# EAGLE schematic balancer (EAGLE 9.6.2)
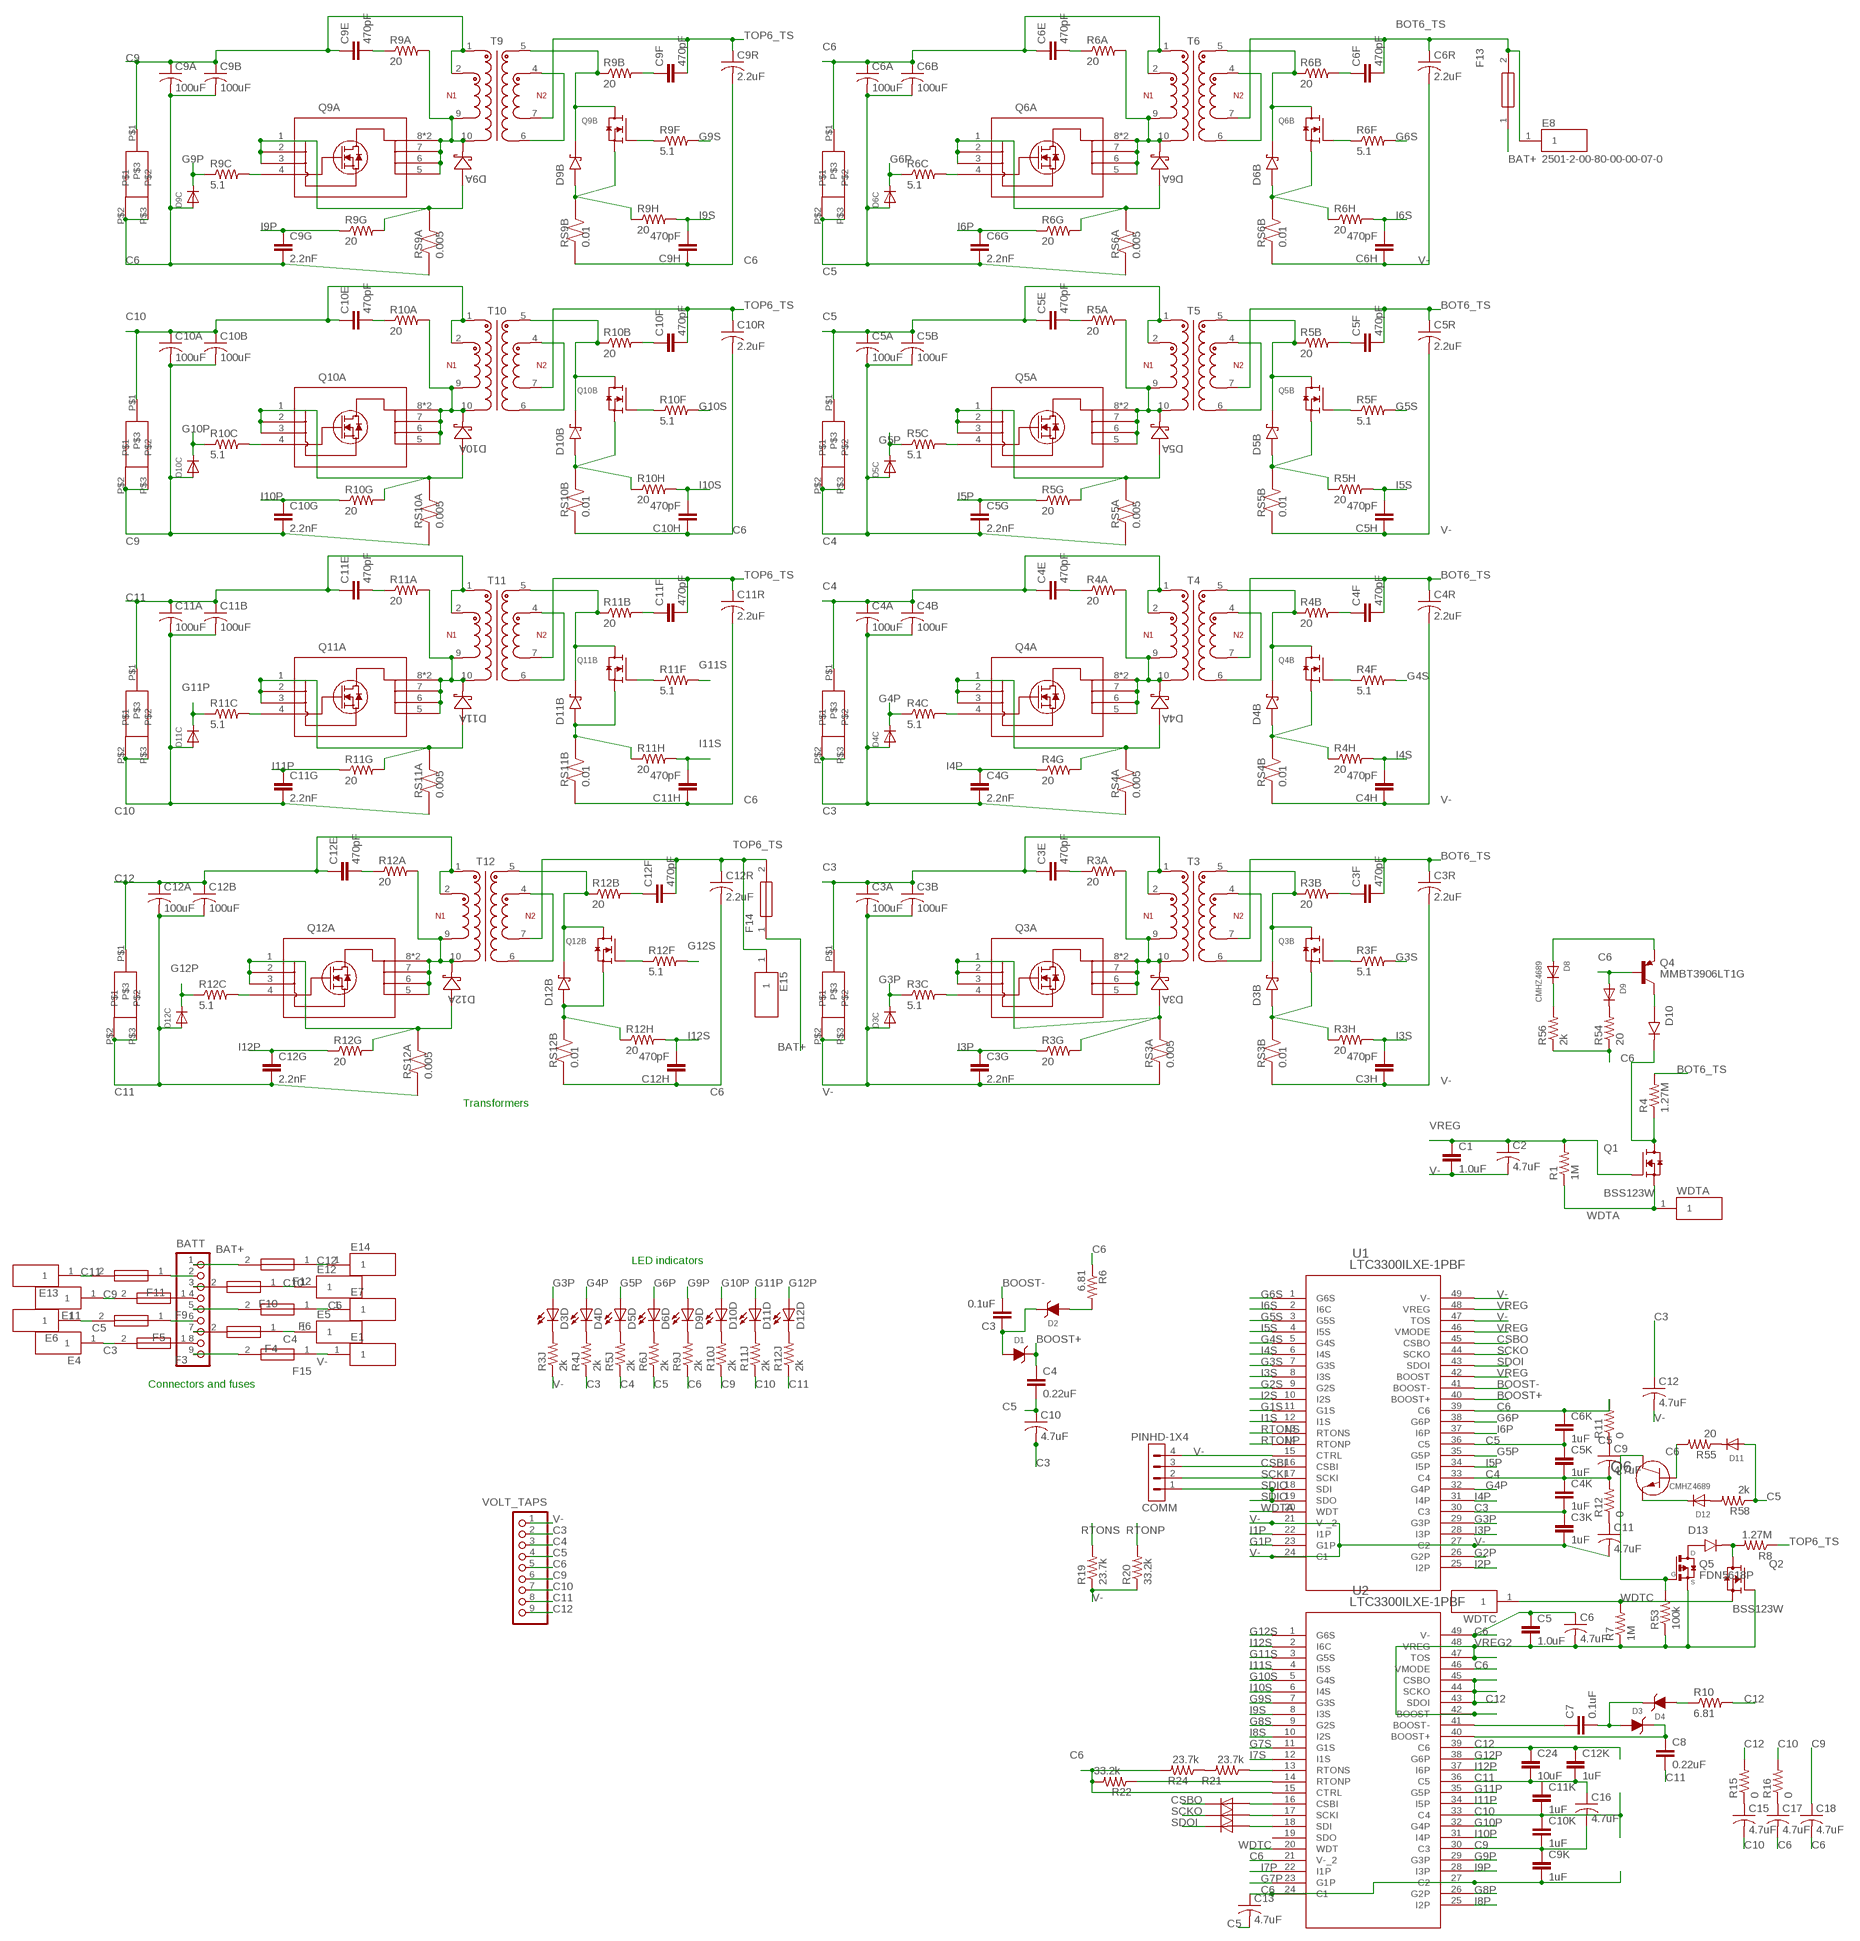
[diagram p0: schematic, sheet 1]

## Parts
BATT  B9P-VH  [B9P-VH]
C1  1.0uF  CAP  [0805]
C2  4.7uF  C-USC1210  [C1210]
C3  0.1uF  CAP  [0805]
C3A  100uF  C-USC1210  [C1210]
C3B  100uF  C-USC1210  [C1210]
C3E  470pF  CAP  [0805]
C3F  470pF  CAP  [0805]
C3G  2.2nF  CAP  [0805]
C3H  470pF  CAP  [0805]
C3K  1uF  CAP  [0805]
C3R  2.2uF  C-USC1210  [C1210]
C4  0.22uF  CAP  [0805]
C4A  100uF  C-USC1210  [C1210]
C4B  100uF  C-USC1210  [C1210]
C4E  470pF  CAP  [0805]
C4F  470pF  CAP  [0805]
C4G  2.2nF  CAP  [0805]
C4H  470pF  CAP  [0805]
C4K  1uF  CAP  [0805]
C4R  2.2uF  C-USC1210  [C1210]
C5  1.0uF  CAP  [0805]
C5A  100uF  C-USC1210  [C1210]
C5B  100uF  C-USC1210  [C1210]
C5E  470pF  CAP  [0805]
C5F  470pF  CAP  [0805]
C5G  2.2nF  CAP  [0805]
C5H  470pF  CAP  [0805]
C5K  1uF  CAP  [0805]
C5R  2.2uF  C-USC1210  [C1210]
C6  4.7uF  C-USC1210  [C1210]
C6A  100uF  C-USC1210  [C1210]
C6B  100uF  C-USC1210  [C1210]
C6E  470pF  CAP  [0805]
C6F  470pF  CAP  [0805]
C6G  2.2nF  CAP  [0805]
C6H  470pF  CAP  [0805]
C6K  1uF  CAP  [0805]
C6R  2.2uF  C-USC1210  [C1210]
C7  0.1uF  CAP  [0805]
C8  0.22uF  CAP  [0805]
C9  4.7uF  C-USC1210  [C1210]
C9A  100uF  C-USC1210  [C1210]
C9B  100uF  C-USC1210  [C1210]
C9E  470pF  CAP  [0805]
C9F  470pF  CAP  [0805]
C9G  2.2nF  CAP  [0805]
C9H  470pF  CAP  [0805]
C9K  1uF  CAP  [0805]
C9R  2.2uF  C-USC1210  [C1210]
C10  4.7uF  C-USC1210  [C1210]
C10A  100uF  C-USC1210  [C1210]
C10B  100uF  C-USC1210  [C1210]
C10E  470pF  CAP  [0805]
C10F  470pF  CAP  [0805]
C10G  2.2nF  CAP  [0805]
C10H  470pF  CAP  [0805]
C10K  1uF  CAP  [0805]
C10R  2.2uF  C-USC1210  [C1210]
C11  4.7uF  C-USC1210  [C1210]
C11A  100uF  C-USC1210  [C1210]
C11B  100uF  C-USC1210  [C1210]
C11E  470pF  CAP  [0805]
C11F  470pF  CAP  [0805]
C11G  2.2nF  CAP  [0805]
C11H  470pF  CAP  [0805]
C11K  1uF  CAP  [0805]
C11R  2.2uF  C-USC1210  [C1210]
C12  4.7uF  C-USC1210  [C1210]
C12A  100uF  C-USC1210  [C1210]
C12B  100uF  C-USC1210  [C1210]
C12E  470pF  CAP  [0805]
C12F  470pF  CAP  [0805]
C12G  2.2nF  CAP  [0805]
C12H  470pF  CAP  [0805]
C12K  1uF  CAP  [0805]
C12R  2.2uF  C-USC1210  [C1210]
C13  4.7uF  C-USC1210  [C1210]
C15  4.7uF  C-USC1210  [C1210]
C16  4.7uF  C-USC1210  [C1210]
C17  4.7uF  C-USC1210  [C1210]
C18  4.7uF  C-USC1210  [C1210]
C24  10uF  CAP  [0805]
COMM  PINHD-1X4  [1X04]
D1  WE-TVSP_DO-214AA_600W_UNI  [WE-TVSP_DO-214AA_UNIDIRECTIONAL]
D2  WE-TVSP_DO-214AA_600W_UNI  [WE-TVSP_DO-214AA_UNIDIRECTIONAL]
D3  WE-TVSP_DO-214AA_600W_UNI  [WE-TVSP_DO-214AA_UNIDIRECTIONAL]
D3A  DFLS260Q-7  [SDO_POWERDI123_DIO]
D3B  DFLS1100-7  [DIO_DFLS1100-7]
D3C  DIODESOD-523  [SOD-523]
D3D  LEDCHIPLED_0805  [CHIPLED_0805]
D3E  SBR10U200P5  [POWERDI5]
D4  WE-TVSP_DO-214AA_600W_UNI  [WE-TVSP_DO-214AA_UNIDIRECTIONAL]
D4A  DFLS260Q-7  [SDO_POWERDI123_DIO]
D4B  DFLS1100-7  [DIO_DFLS1100-7]
D4C  DIODESOD-523  [SOD-523]
D4D  LEDCHIPLED_0805  [CHIPLED_0805]
D4E  SBR10U200P5  [POWERDI5]
D5  RS07J-GS18  [SODFL3718X108N]
D5A  DFLS260Q-7  [SDO_POWERDI123_DIO]
D5B  DFLS1100-7  [DIO_DFLS1100-7]
D5C  DIODESOD-523  [SOD-523]
D5D  LEDCHIPLED_0805  [CHIPLED_0805]
D5E  SBR10U200P5  [POWERDI5]
D6  RS07J-GS18  [SODFL3718X108N]
D6A  DFLS260Q-7  [SDO_POWERDI123_DIO]
D6B  DFLS1100-7  [DIO_DFLS1100-7]
D6C  DIODESOD-523  [SOD-523]
D6D  LEDCHIPLED_0805  [CHIPLED_0805]
D6E  SBR10U200P5  [POWERDI5]
D7  RS07J-GS18  [SODFL3718X108N]
D8  CMHZ4689  DIODESOD-123  [SOD-123]
D9  PDZ5.6B  DIODESOD-323F  [SOD-323F]
D9A  DFLS260Q-7  [SDO_POWERDI123_DIO]
D9B  DFLS1100-7  [DIO_DFLS1100-7]
D9C  DIODESOD-523  [SOD-523]
D9D  LEDCHIPLED_0805  [CHIPLED_0805]
D9E  SBR10U200P5  [POWERDI5]
D10  1N4448HWT-7  [SODFL1608X65N]
D10A  DFLS260Q-7  [SDO_POWERDI123_DIO]
D10B  DFLS1100-7  [DIO_DFLS1100-7]
D10C  DIODESOD-523  [SOD-523]
D10D  LEDCHIPLED_0805  [CHIPLED_0805]
D10E  SBR10U200P5  [POWERDI5]
D11  PDZ5.6B  DIODESOD-323F  [SOD-323F]
D11A  DFLS260Q-7  [SDO_POWERDI123_DIO]
D11B  DFLS1100-7  [DIO_DFLS1100-7]
D11C  DIODESOD-523  [SOD-523]
D11D  LEDCHIPLED_0805  [CHIPLED_0805]
D11E  SBR10U200P5  [POWERDI5]
D12  CMHZ4689  DIODESOD-123  [SOD-123]
D12A  DFLS260Q-7  [SDO_POWERDI123_DIO]
D12B  DFLS1100-7  [DIO_DFLS1100-7]
D12C  DIODESOD-523  [SOD-523]
D12D  LEDCHIPLED_0805  [CHIPLED_0805]
D12E  SBR10U200P5  [POWERDI5]
D13  1N4448HWT-7  [SODFL1608X65N]
E1  2501-2-00-80-00-00-07-0  [MILMAX_2501-2-00-80-00-00-07-0]
E4  2501-2-00-80-00-00-07-0  [MILMAX_2501-2-00-80-00-00-07-0]
E5  2501-2-00-80-00-00-07-0  [MILMAX_2501-2-00-80-00-00-07-0]
E6  2501-2-00-80-00-00-07-0  [MILMAX_2501-2-00-80-00-00-07-0]
E7  2501-2-00-80-00-00-07-0  [MILMAX_2501-2-00-80-00-00-07-0]
E8  2501-2-00-80-00-00-07-0  [MILMAX_2501-2-00-80-00-00-07-0]
E11  2501-2-00-80-00-00-07-0  [MILMAX_2501-2-00-80-00-00-07-0]
E12  2501-2-00-80-00-00-07-0  [MILMAX_2501-2-00-80-00-00-07-0]
E13  2501-2-00-80-00-00-07-0  [MILMAX_2501-2-00-80-00-00-07-0]
E14  2501-2-00-80-00-00-07-0  [MILMAX_2501-2-00-80-00-00-07-0]
E15  2501-2-00-80-00-00-07-0  [MILMAX_2501-2-00-80-00-00-07-0]
F3  01530008Z  [01530008]
F4  01530008Z  [01530008]
F5  01530008Z  [01530008]
F6  01530008Z  [01530008]
F9  01530008Z  [01530008]
F10  01530008Z  [01530008]
F11  01530008Z  [01530008]
F12  01530008Z  [01530008]
F13  01530008Z  [01530008]
F14  01530008Z  [01530008]
F15  01530008Z  [01530008]
Q1  BSS123W  [TRANS_BSS123W]
Q2  BSS123W  [TRANS_BSS123W]
Q3A  SIR882DP-T1-GE3  [POWERPAK_SO-8_SINGLE_VIS]
Q3B  SIS468DN-T1-GE3  [VISHAY_SIS468DN-T1-GE3]
Q4  MMBT3906LT1G  [SOT95P240X111-3N]
Q4A  SIR882DP-T1-GE3  [POWERPAK_SO-8_SINGLE_VIS]
Q4B  SIS468DN-T1-GE3  [VISHAY_SIS468DN-T1-GE3]
Q5  FDN5618P  [SSOT-3]
Q5A  SIR882DP-T1-GE3  [POWERPAK_SO-8_SINGLE_VIS]
Q5B  SIS468DN-T1-GE3  [VISHAY_SIS468DN-T1-GE3]
Q6  CMPT3904E_TR_PBFREE  [CMPT-3904-NPN_CNS]
Q6A  SIR882DP-T1-GE3  [POWERPAK_SO-8_SINGLE_VIS]
Q6B  SIS468DN-T1-GE3  [VISHAY_SIS468DN-T1-GE3]
Q9A  SIR882DP-T1-GE3  [POWERPAK_SO-8_SINGLE_VIS]
Q9B  SIS468DN-T1-GE3  [VISHAY_SIS468DN-T1-GE3]
Q10A  SIR882DP-T1-GE3  [POWERPAK_SO-8_SINGLE_VIS]
Q10B  SIS468DN-T1-GE3  [VISHAY_SIS468DN-T1-GE3]
Q11A  SIR882DP-T1-GE3  [POWERPAK_SO-8_SINGLE_VIS]
Q11B  SIS468DN-T1-GE3  [VISHAY_SIS468DN-T1-GE3]
Q12A  SIR882DP-T1-GE3  [POWERPAK_SO-8_SINGLE_VIS]
Q12B  SIS468DN-T1-GE3  [VISHAY_SIS468DN-T1-GE3]
R1  1M  RES  [0805]
R3A  20  R-US_R1206  [R1206]
R3B  20  R-US_R1206  [R1206]
R3C  5.1  RES  [0805]
R3F  5.1  RES  [0805]
R3G  20  RES  [0805]
R3H  20  RES  [0805]
R3J  2k  R-US_R0805  [R0805]
R4  1.27M  RES  [0805]
R4A  20  R-US_R1206  [R1206]
R4B  20  R-US_R1206  [R1206]
R4C  5.1  RES  [0805]
R4F  5.1  RES  [0805]
R4G  20  RES  [0805]
R4H  20  RES  [0805]
R4J  2k  R-US_R0805  [R0805]
R5A  20  R-US_R1206  [R1206]
R5B  20  R-US_R1206  [R1206]
R5C  5.1  RES  [0805]
R5F  5.1  RES  [0805]
R5G  20  RES  [0805]
R5H  20  RES  [0805]
R5J  2k  R-US_R0805  [R0805]
R6  6.81  RES  [0805]
R6A  20  R-US_R1206  [R1206]
R6B  20  R-US_R1206  [R1206]
R6C  5.1  RES  [0805]
R6F  5.1  RES  [0805]
R6G  20  RES  [0805]
R6H  20  RES  [0805]
R6J  2k  R-US_R0805  [R0805]
R7  1M  RES  [0805]
R8  1.27M  RES  [0805]
R9A  20  R-US_R1206  [R1206]
R9B  20  R-US_R1206  [R1206]
R9C  5.1  RES  [0805]
R9F  5.1  RES  [0805]
R9G  20  RES  [0805]
R9H  20  RES  [0805]
R9J  2k  R-US_R0805  [R0805]
R10  6.81  RES  [0805]
R10A  20  R-US_R1206  [R1206]
R10B  20  R-US_R1206  [R1206]
R10C  5.1  RES  [0805]
R10F  5.1  RES  [0805]
R10G  20  RES  [0805]
R10H  20  RES  [0805]
R10J  2k  R-US_R0805  [R0805]
R11  0  R-US_R2512  [R2512]
R11A  20  R-US_R1206  [R1206]
R11B  20  R-US_R1206  [R1206]
R11C  5.1  RES  [0805]
R11F  5.1  RES  [0805]
R11G  20  RES  [0805]
R11H  20  RES  [0805]
R11J  2k  R-US_R0805  [R0805]
R12  0  R-US_R2512  [R2512]
R12A  20  R-US_R1206  [R1206]
R12B  20  R-US_R1206  [R1206]
R12C  5.1  RES  [0805]
R12F  5.1  RES  [0805]
R12G  20  RES  [0805]
R12H  20  RES  [0805]
R12J  2k  R-US_R0805  [R0805]
R15  0  R-US_R2512  [R2512]
R16  0  R-US_R2512  [R2512]
R19  23.7k  RES  [0805]
R20  33.2k  RES  [0805]
R21  23.7k  RES  [0805]
R22  33.2k  RES  [0805]
R24  23.7k  RES  [0805]
R53  100k  RES  [0805]
R54  20  RES  [0805]
R55  20  RES  [0805]
R56  2k  RES  [0805]
R58  2k  RES  [0805]
RS3A  0.005  PRL1632-R010-F-T1  [RESC1632X60N]
RS3B  0.01  PRL1632-R010-F-T1  [RESC1632X60N]
RS4A  0.005  PRL1632-R010-F-T1  [RESC1632X60N]
RS4B  0.01  PRL1632-R010-F-T1  [RESC1632X60N]
RS5A  0.005  PRL1632-R010-F-T1  [RESC1632X60N]
RS5B  0.01  PRL1632-R010-F-T1  [RESC1632X60N]
RS6A  0.005  PRL1632-R010-F-T1  [RESC1632X60N]
RS6B  0.01  PRL1632-R010-F-T1  [RESC1632X60N]
RS9A  0.005  PRL1632-R010-F-T1  [RESC1632X60N]
RS9B  0.01  PRL1632-R010-F-T1  [RESC1632X60N]
RS10A  0.005  PRL1632-R010-F-T1  [RESC1632X60N]
RS10B  0.01  PRL1632-R010-F-T1  [RESC1632X60N]
RS11A  0.005  PRL1632-R010-F-T1  [RESC1632X60N]
RS11B  0.01  PRL1632-R010-F-T1  [RESC1632X60N]
RS12A  0.005  PRL1632-R010-F-T1  [RESC1632X60N]
RS12B  0.01  PRL1632-R010-F-T1  [RESC1632X60N]
T3  750312504  [WE-FLYLT_EP13_2381]
T4  750312504  [WE-FLYLT_EP13_2381]
T5  750312504  [WE-FLYLT_EP13_2381]
T6  750312504  [WE-FLYLT_EP13_2381]
T9  750312504  [WE-FLYLT_EP13_2381]
T10  750312504  [WE-FLYLT_EP13_2381]
T11  750312504  [WE-FLYLT_EP13_2381]
T12  750312504  [WE-FLYLT_EP13_2381]
U1  LTC3300ILXE-1PBF  [05-08-1832_ADI]
U2  LTC3300ILXE-1PBF  [05-08-1832_ADI]
VOLT_TAPS  B9P-VH  [B9P-VH]
WDTA  2501-2-00-80-00-00-07-0  [MILMAX_2501-2-00-80-00-00-07-0]
WDTC  2501-2-00-80-00-00-07-0  [MILMAX_2501-2-00-80-00-00-07-0]

## Nets
BAT+: BATT.1 F12.2 F13.1 F14.1
BOOST+: C4.1 D1.1(C) U1.40(BOOST+)
BOOST-: C3.2 U1.41(BOOST-)
BOT6_TS: C3F.2 C3R.1 C4F.2 C4R.1 C5F.2 C5R.1 C6F.2 C6R.1 E8.1 F13.2 R4.2 T3.7 T4.7 T5.7 T6.7
C: D5.A U2.16(CSBI)
C3: C3A.1 C3B.1 C3E.1 C3K.1 C4A.2 C4B.2 C4G.2 C4K.2 C10.2 C12.1 D3E.P$1 D4C.A D4E.P$2 D4E.P$3 E4.1 F3.2 R4J.1 RS4A.1 T3.1 T3.2 U1.30(C3) VOLT_TAPS.2
C4: C4A.1 C4B.1 C4E.1 C4K.1 C5A.2 C5B.2 C5G.2 C5K.2 C9.2 D4E.P$1 D5C.A D5E.P$2 D5E.P$3 E5.1 F4.1 R5J.1 R12.2 RS5A.1 T4.1 T4.2 U1.33(C4) VOLT_TAPS.3
C5: C4.2 C5A.1 C5B.1 C5E.1 C5K.1 C6A.2 C6B.2 C6G.2 C6K.2 C10.1 C13.2 D5E.P$1 D6C.A D6E.P$2 D6E.P$3 D11.A E6.1 F5.2 R6J.1 R58.1 RS6A.1 T5.1 T5.2 U1.36(C5) VOLT_TAPS.4
C6: C5.1 C6.1 C6A.1 C6B.1 C6E.1 C6K.1 C9A.2 C9B.2 C9G.2 C9H.1 C9K.2 C9R.2 C10H.1 C10R.2 C11H.1 C11R.2 C12H.1 C12R.2 C13.1 C17.2 C18.2 D6E.P$1 D9.A D9C.A D9E.P$2 D9E.P$3 E7.1 F6.1 Q4.1(B) Q6.1 R6.1 R9J.1 R11.2 R22.2 R24.2 R54.1 R55.2 R56.1 RS9A.1 RS9B.1 RS10B.1 RS11B.1 RS12B.1 T6.1 T6.2 U1.39(C6) U2.15(CTRL) U2.21(V-_2) U2.24(C1) U2.27(C2) U2.46(VMODE) U2.49(V-) VOLT_TAPS.5
C9: C9A.1 C9B.1 C9E.1 C9K.1 C10A.2 C10B.2 C10G.2 C10K.2 C16.2 C18.1 D9E.P$1 D10C.A D10E.P$2 D10E.P$3 E11.1 F9.2 R10J.1 RS10A.1 T9.1 T9.2 U2.30(C3) VOLT_TAPS.6
C10: C10A.1 C10B.1 C10E.1 C10K.1 C11A.2 C11B.2 C11G.2 C11K.2 C15.2 D10E.P$1 D11C.A D11E.P$2 D11E.P$3 E12.1 F10.1 R11J.1 R16.2 RS11A.1 T10.1 T10.2 U2.33(C4) VOLT_TAPS.7
C11: C8.2 C11A.1 C11B.1 C11E.1 C11K.1 C12A.2 C12B.2 C12G.2 C12K.2 C16.1 C24.2 D11E.P$1 D12C.A D12E.P$2 D12E.P$3 E13.1 F11.2 R12J.1 RS12A.1 T11.1 T11.2 U2.36(C5) VOLT_TAPS.8
C12: C12A.1 C12B.1 C12E.1 C12K.1 C24.1 D12E.P$1 E14.1 F12.1 R10.2 R15.2 T12.1 T12.2 U2.39(C6) U2.43(SDOI) U2.44(SCKO) U2.45(CSBO) VOLT_TAPS.9
CSBI: COMM.3 U1.16(CSBI)
CSBO: D5.C U1.45(CSBO)
G1P: U1.23(G1P)
G1S: U1.11(G1S)
G2P: U1.26(G2P)
G2S: U1.9(G2S)
G3P: D3C.K(C) D3D.A R3C.1 U1.29(G3P)
G3S: R3F.2 U1.7(G3S)
G4P: D4C.K(C) D4D.A R4C.1 U1.32(G4P)
G4S: R4F.2 U1.5(G4S)
G5P: D5C.K(C) D5D.A R5C.1 U1.35(G5P)
G5S: R5F.2 U1.3(G5S)
G6P: D6C.K(C) D6D.A R6C.1 U1.38(G6P)
G6S: R6F.2 U1.1(G6S)
G7P: U2.23(G1P)
G7S: U2.11(G1S)
G8P: U2.26(G2P)
G8S: U2.9(G2S)
G9P: D9C.K(C) D9D.A R9C.1 U2.29(G3P)
G9S: R9F.2 U2.7(G3S)
G10P: D10C.K(C) D10D.A R10C.1 U2.32(G4P)
G10S: R10F.2 U2.5(G4S)
G11P: D11C.K(C) D11D.A R11C.1 U2.35(G5P)
G11S: R11F.2 U2.3(G5S)
G12P: D12C.K(C) D12D.A R12C.1 U2.38(G6P)
G12S: R12F.2 U2.1(G6S)
I1P: U1.22(I1P)
I1S: U1.12(I1S)
I2P: U1.25(I2P)
I2S: U1.10(I2S)
I3P: C3G.1 R3G.1 U1.28(I3P)
I3S: C3H.2 R3H.2 U1.8(I3S)
I4P: C4G.1 R4G.1 U1.31(I4P)
I4S: C4H.2 R4H.2 U1.6(I4S)
I5P: C5G.1 R5G.1 U1.34(I5P)
I5S: C5H.2 R5H.2 U1.4(I5S)
I6P: C6G.1 R6G.1 U1.37(I6P)
I6S: C6H.2 R6H.2 U1.2(I6C)
I7P: U2.22(I1P)
I7S: U2.12(I1S)
I8P: U2.25(I2P)
I8S: U2.10(I2S)
I9P: C9G.1 R9G.1 U2.28(I3P)
I9S: C9H.2 R9H.2 U2.8(I3S)
I10P: C10G.1 R10G.1 U2.31(I4P)
I10S: C10H.2 R10H.2 U2.6(I4S)
I11P: C11G.1 R11G.1 U2.34(I5P)
I11S: C11H.2 R11H.2 U2.4(I5S)
I12P: C12G.1 R12G.1 U2.37(I6P)
I12S: C12H.2 R12H.2 U2.2(I6C)
N$1: C3.1 D1.2(A) D2.1(C)
N$2: D2.2(A) R6.2
N$3: D10.A Q4.3(C)
N$4: D8.C R56.2
N$5: D10.C(K) Q1.3(D) R4.1
N$6: D8.A Q4.2(E)
N$7: D9.C R54.2
N$8: Q3A.4 R3C.2
N$9: D3D.C R3J.2
N$10: T3.4 T3.6
N$11: C3E.2 R3A.1
N$12: D4D.C R4J.2
N$13: D5D.C R5J.2
N$14: BATT.2 F11.1
N$15: D3A.2 Q3A.5 Q3A.6 Q3A.7 Q3A.8 Q3A.9 R3A.2 T3.9 T3.10
N$16: D3A.1 Q3A.1 Q3A.2 Q3A.3 R3G.2 RS3A.2
N$17: C3F.1 R3B.2
N$18: BATT.3 F10.2
N$19: D3B.K Q3B.5(D) Q3B.6(D) Q3B.7(D) Q3B.8(D) Q3B.9(D) R3B.1 T3.5
N$20: D3B.A Q3B.1(S) Q3B.2(S) Q3B.3(S) R3H.1 RS3B.2
N$21: Q3B.4(G) R3F.1
N$22: BATT.4 F9.1
N$23: BATT.5 F6.2
N$24: Q4A.4 R4C.2
N$25: BATT.6 F5.1
N$26: BATT.7 F4.2
N$27: C4E.2 R4A.1
N$28: BATT.8 F3.1
N$29: D4A.2 Q4A.5 Q4A.6 Q4A.7 Q4A.8 Q4A.9 R4A.2 T4.9 T4.10
N$30: BATT.9 F15.2
N$31: D4A.1 Q4A.1 Q4A.2 Q4A.3 R4G.2 RS4A.2
N$32: T4.4 T4.6
N$33: C4F.1 R4B.2
N$34: D6D.C R6J.2
N$35: D4B.K Q4B.5(D) Q4B.6(D) Q4B.7(D) Q4B.8(D) Q4B.9(D) R4B.1 T4.5
N$36: D4B.A Q4B.1(S) Q4B.2(S) Q4B.3(S) R4H.1 RS4B.2
N$37: D9D.C R9J.2
N$38: Q4B.4(G) R4F.1
N$39: D10D.C R10J.2
N$40: Q5A.4 R5C.2
N$41: D11D.C R11J.2
N$42: D12D.C R12J.2
N$43: C5E.2 R5A.1
N$44: R21.2 R24.1
N$45: D5A.2 Q5A.5 Q5A.6 Q5A.7 Q5A.8 Q5A.9 R5A.2 T5.9 T5.10
N$46: C7.2 D3.2(A) D4.1(C)
N$47: D5A.1 Q5A.1 Q5A.2 Q5A.3 R5G.2 RS5A.2
N$48: T5.4 T5.6
N$49: C5F.1 R5B.2
N$50: D13.C(K) Q2.3(D) R8.2
N$51: D5B.K Q5B.5(D) Q5B.6(D) Q5B.7(D) Q5B.8(D) Q5B.9(D) R5B.1 T5.5
N$52: D5B.A Q5B.1(S) Q5B.2(S) Q5B.3(S) R5H.1 RS5B.2
N$53: D4.2(A) R10.1
N$54: Q5B.4(G) R5F.1
N$55: D13.A Q5.3(D)
N$56: Q6A.4 R6C.2
N$57: Q5.1(G) Q6.3 R53.2
N$58: D12.C Q6.2
N$59: C6E.2 R6A.1
N$60: D12.A R58.2
N$61: D6A.2 Q6A.5 Q6A.6 Q6A.7 Q6A.8 Q6A.9 R6A.2 T6.9 T6.10
N$62: D11.C R55.1
N$63: D6A.1 Q6A.1 Q6A.2 Q6A.3 R6G.2 RS6A.2
N$64: T6.4 T6.6
N$65: C6F.1 R6B.2
N$66: C9.1 R11.1
N$67: D6B.K Q6B.5(D) Q6B.6(D) Q6B.7(D) Q6B.8(D) Q6B.9(D) R6B.1 T6.5
N$68: D6B.A Q6B.1(S) Q6B.2(S) Q6B.3(S) R6H.1 RS6B.2
N$69: C11.1 R12.1
N$70: Q6B.4(G) R6F.1
N$72: Q9A.4 R9C.2
N$73: R21.1 U2.13(RTONS)
N$74: R22.1 U2.14(RTONP)
N$75: C9E.2 R9A.1
N$76: C15.1 R15.1
N$77: D9A.2 Q9A.5 Q9A.6 Q9A.7 Q9A.8 Q9A.9 R9A.2 T9.9 T9.10
N$79: D9A.1 Q9A.1 Q9A.2 Q9A.3 R9G.2 RS9A.2
N$80: T9.4 T9.6
N$81: C9F.1 R9B.2
N$82: D6.A U2.17(SCKI)
N$83: D9B.K Q9B.5(D) Q9B.6(D) Q9B.7(D) Q9B.8(D) Q9B.9(D) R9B.1 T9.5
N$84: D9B.A Q9B.1(S) Q9B.2(S) Q9B.3(S) R9H.1 RS9B.2
N$85: D7.A U2.18(SDI)
N$86: Q9B.4(G) R9F.1
N$88: Q10A.4 R10C.2
N$91: C10E.2 R10A.1
N$92: C17.1 R16.1
N$93: D10A.2 Q10A.5 Q10A.6 Q10A.7 Q10A.8 Q10A.9 R10A.2 T10.9 T10.10
N$95: D10A.1 Q10A.1 Q10A.2 Q10A.3 R10G.2 RS10A.2
N$96: T10.4 T10.6
N$97: C10F.1 R10B.2
N$99: D10B.K Q10B.5(D) Q10B.6(D) Q10B.7(D) Q10B.8(D) Q10B.9(D) R10B.1 T10.5
N$100: D10B.A Q10B.1(S) Q10B.2(S) Q10B.3(S) R10H.1 RS10B.2
N$102: Q10B.4(G) R10F.1
N$104: Q11A.4 R11C.2
N$107: C11E.2 R11A.1
N$109: D11A.2 Q11A.5 Q11A.6 Q11A.7 Q11A.8 Q11A.9 R11A.2 T11.9 T11.10
N$111: D11A.1 Q11A.1 Q11A.2 Q11A.3 R11G.2 RS11A.2
N$112: T11.4 T11.6
N$113: C11F.1 R11B.2
N$115: D11B.K Q11B.5(D) Q11B.6(D) Q11B.7(D) Q11B.8(D) Q11B.9(D) R11B.1 T11.5
N$116: D11B.A Q11B.1(S) Q11B.2(S) Q11B.3(S) R11H.1 RS11B.2
N$118: Q11B.4(G) R11F.1
N$120: Q12A.4 R12C.2
N$123: C12E.2 R12A.1
N$125: D12A.2 Q12A.5 Q12A.6 Q12A.7 Q12A.8 Q12A.9 R12A.2 T12.9 T12.10
N$127: D12A.1 Q12A.1 Q12A.2 Q12A.3 R12G.2 RS12A.2
N$128: T12.4 T12.6
N$129: C12F.1 R12B.2
N$131: D12B.K Q12B.5(D) Q12B.6(D) Q12B.7(D) Q12B.8(D) Q12B.9(D) R12B.1 T12.5
N$132: D12B.A Q12B.1(S) Q12B.2(S) Q12B.3(S) R12H.1 RS12B.2
N$134: Q12B.4(G) R12F.1
N$135: C8.1 D3.1(C) U2.40(BOOST+)
N$152: C7.1 U2.41(BOOST-)
RTONP: R20.2 U1.14(RTONP)
RTONS: R19.2 U1.13(RTONS)
SCKI: COMM.2 U1.17(SCKI)
SCKO: D6.C U1.44(SCKO)
SDIO: COMM.1 U1.18(SDI) U1.19(SDO)
SDOI: D7.C U1.43(SDOI)
TOP6_TS: C9F.2 C9R.1 C10F.2 C10R.1 C11F.2 C11R.1 C12F.2 C12R.1 E15.1 F14.2 R8.1 T9.7 T10.7 T11.7 T12.7
V-: C1.2 C2.2 C3A.2 C3B.2 C3G.2 C3H.1 C3K.2 C3R.2 C4H.1 C4R.2 C5H.1 C5R.2 C6H.1 C6R.2 C11.2 C12.2 COMM.4 D3C.A D3E.P$2 D3E.P$3 E1.1 F15.1 R3J.1 R19.1 R20.1 RS3A.1 RS3B.1 RS4B.1 RS5B.1 RS6B.1 U1.15(CTRL) U1.21(V-_2) U1.24(C1) U1.27(C2) U1.47(TOS) U1.49(V-) VOLT_TAPS.1
VREG: C1.1 C2.1 Q1.1(G) R1.2 U1.42(BOOST) U1.46(VMODE) U1.48(VREG)
VREG2: C5.2 C6.2 Q2.1(G) Q5.2(S) R7.1 R53.1 U2.42(BOOST) U2.47(TOS) U2.48(VREG)
WDTA: Q1.2(S) R1.1 U1.20(WDT) WDTA.1
WDTC: Q2.2(S) R7.2 U2.20(WDT) WDTC.1
Unconnected: U2.19(SDO)

## Notes on the sheet
- Transformers
- LED indicators
- Connectors and fuses

## Library data of the parts
BATT VOLT_TAPS = jst-vh:B9P-VH: Wire-to-Board 3.96mm pitch top mount connector Source: http://www.jst-mfg.com/product/pdf/jpn/VH.pdf http://www.jst-mfg.com/product/detail.php?series=262
C1 C3 C3E C3F C3G C3H C3K C4 C4E C4F C4G C4H C4K C5 C5E C5F C5G C5H C5K C6E C6F C6G C6H C6K C7 C8 C9E C9F C9G C9H C9K C10E C10F C10G C10H C10K C11E C11F C11G C11H C11K C12E C12F C12G C12H C12K C24 = Ilya_Teach:CAP
C2 C3A C3B C3R C4A C4B C4R C5A C5B C5R C6 C6A C6B C6R C9 C9A C9B C9R C10 C10A C10B C10R C11 C11A C11B C11R C12 C12A C12B C12R C13 C15-C18 = rcl:C-US: CAPACITOR, American symbol; SPICEPREFIX: C
COMM = Connector:PINHD-1X4: Pin Header; CATEGORY: Connectors; DESCRIPTION: Header-Straight-4 Position; PACKAGE_TYPE: Through Hole; PITCH: 0.100" (2.54mm); SUBCATEGORY: Headers; TYPE: Male Pins
D1-D4 = DO-214AA:WE-TVSP_DO-214AA_600W_UNI: Check availability <https://pricing.snapeda.com/parts/824520141/W%C3%BCrth%20Elektronik/view-part?ref=eda>; AVAILABILITY: In Stock; CHECK_PRICES: https://www.snapeda.com/parts/824520141/W%25C3%25BCrth+Elektronik+Midcom/view-part/?ref=eda; DESCRIPTION: 23.2V Clamp 25.9A Ipp Tvs Diode Surface Mount DO-214AA; MF: Würth Elektronik; MP: 824520141; PACKAGE: DO-214 Würth Elektronik; PRICE: None; SNAPEDA_LINK: https://www.snapeda.com/parts/824520141/W%25C3%25BCrth+Elektronik+Midcom/view-part/?ref=snap
D3A D4A D5A D6A D9A D10A D11A D12A = balancer:DFLS260Q-7; COPYRIGHT: Copyright (C) 2026 Ultra Librarian. All rights reserved.; MANUFACTURER_NAME: Diodes Inc; MANUFACTURER_PART_NUMBER: DFLS260Q-7
D3B D4B D5B D6B D9B D10B D11B D12B = DFLS1100-7:DFLS1100-7; MANUFACTURER: Diodes Inc.; MAXIMUM_PACKAGE_HEIGHT: 1.00 mm; PARTREV: 14-2; SNAPEDA_PN: DFLS1100-7; STANDARD: Manufacturer Recommendations
D3C D4C D5C D6C D8 D9 D9C D10C D11 D11C D12 D12C = adafruit:DIODE: Diode SMADIODE - SMA Surface Mount Package 20V 1A Schottky Diode Digikey: 641-1014-6-ND DO-1N4148 - Through Hole Small Current Diode SOD-123 20V 1 A (.5mV Vf) Schottky Diode - Digikey: MBRX120TPMSCT-ND SOD-323 10V 570mA (.38mV Vf, 3ns) Schottky Diode - Digikey: ZLLS410CT-ND SOD-523 30V 30mA Schottky Diode (RB751S-40TE61) - Digikey: RB751S-40TE61CT-ND SOT23-R/W - SOT23 Package (R = Solder Paste/Reflow Ovens, W = Hand-Soldering) BAT54Film 40V 300mA - Digikey: 497-7162-1-ND
D3D D4D D5D D6D D9D D10D D11D D12D = adafruit:LED: LED OSRAM: - CHIPLED LG R971, LG N971, LY N971, LG Q971, LY Q971, LO R971, LY R971 LH N974, LH R974 LS Q976, LO Q976, LY Q976 LO Q996 - Hyper CHIPLED LW Q18S LB Q993, LB Q99A, LB R99A - SideLED LS A670, LO A670, LY A670, LG A670, LP A670 LB A673, LV A673, LT A673, LW A673 LH A674 LY A675 LS A676, LA A676, LO A676, LY A676, LW A676 LS A679, LY A679, LG A679 - Hyper Micro SIDELED® LS Y876, LA Y876, LO Y876, LY Y876 LT Y87S - SmartLED LW L88C, LW L88S LB L89C, LB L89S, LG L890 LS L89K, LO L89K, LY L89K LS L896, LA L896, LO L896, LY L896 - TOPLED LS T670, LO T670, LY T670, LG T670, LP T670 LSG T670, LSP T670, LSY T670, LOP T670, LYG T670 LG T671, LOG T671, LSG T671 LB T673, LV T673, LT T673, LW T673 LH T674 LS T676, LA T676, LO T676, LY T676, LB T676, LH T676, LSB T676, LW T676 LB T67C, LV T67C, LT T67C, LS T67K, LO T67K, LY T67K, LW E67C LS E67B, LA E67B, LO E67B, LY E67B, LB E67C, LV E67C, LT E67C LW T67C LS T679, LY T679, LG T679 LS T770, LO T770, LY T770, LG T770, LP T770 LB T773, LV T773, LT T773, LW T773 LH T774 LS E675, LA E675, LY E675, LS T675 LS T776, LA T776, LO T776, LY T776, LB T776 LHGB T686 LT T68C, LB T68C - Hyper Mini TOPLED® LB M676 - Mini TOPLED Santana® LG M470 LS M47K, LO M47K, LY M47K Source: http://www.osram.convergy.de/
D3E D4E D5E D6E D9E D10E D11E D12E = balancer:SBR10U200P5
D5-D7 = RS07J-GS18:RS07J-GS18: Check availability <https://pricing.snapeda.com/parts/RS07J-GS18/Vishay%20Semiconductor/view-part?ref=eda>; AVAILABILITY: In Stock; CHECK_PRICES: https://www.snapeda.com/parts/RS07J-GS18/Vishay/view-part/?ref=eda; DESCRIPTION: Diode Standard 600 V 500mA Surface Mount DO-219AB (SMF); MF: Vishay Semiconductor; MP: RS07J-GS18; PACKAGE: DO-219AB Vishay Semiconductor Diodes Division; PRICE: None; PURCHASE-URL: https://www.snapeda.com/api/url_track_click_mouser/?unipart_id=383103&manufacturer=Vishay Semiconductor&part_name=RS07J-GS18&search_term=rs07j; SNAPEDA_LINK: https://www.snapeda.com/parts/RS07J-GS18/Vishay/view-part/?ref=snap
D10 D13 = CMOD6263:1N4448HWT-7: Check availability <https://pricing.snapeda.com/parts/1N4448HWT-7/Diodes%20Inc./view-part?ref=eda>; AVAILABILITY: In Stock; CHECK_PRICES: https://www.snapeda.com/parts/1N4448HWT-7/Diodes+Inc./view-part/?ref=eda; DESCRIPTION: Diode Switching 0.125A 80V SOD523 | Diodes Inc 1N4448HWT-7; MF: Diodes Inc.; MP: 1N4448HWT-7; PACKAGE: SOD-523 Diodes Inc.; PRICE: None; SNAPEDA_LINK: https://www.snapeda.com/parts/1N4448HWT-7/Diodes+Inc./view-part/?ref=snap
E1 E4-E8 E11-E15 WDTA WDTC = Turret:2501-2-00-80-00-00-07-0; MANUFACTURER: MILMAX
F3-F6 F9-F15 = 01530008Z:01530008Z: Check availability <https://pricing.snapeda.com/parts/01530008Z/Littelfuse%20Inc./view-part?ref=eda>; AVAILABILITY: In Stock; CHECK_PRICES: https://www.snapeda.com/parts/01530008Z/Littelfuse/view-part/?ref=eda; DESCRIPTION: Fuse Holder 15 A 32V 1 Circuit Blade Through Hole; MF: Littelfuse Inc.; MP: 01530008Z; PACKAGE: None; PRICE: None; PURCHASE-URL: https://www.snapeda.com/api/url_track_click_mouser/?unipart_id=433762&manufacturer=Littelfuse Inc.&part_name=01530008Z&search_term=01530008z; SNAPEDA_LINK: https://www.snapeda.com/parts/01530008Z/Littelfuse/view-part/?ref=snap
Q1 Q2 = BSS123W:BSS123W: Check availability <https://pricing.snapeda.com/parts/BSS123W/Taiwan%20Semiconductor%20Corporation/view-part?ref=eda>; AVAILABILITY: In Stock; CHECK_PRICES: https://www.snapeda.com/parts/BSS123W/taiwan/view-part/?ref=eda; DESCRIPTION: 100V, 0.16A, Single N-Channel Small-signal MOSFETs; MF: Taiwan Semiconductor Corporation; MP: BSS123W; PACKAGE: SOT-323-3 Taiwan Semiconductor; PRICE: None; SNAPEDA_LINK: https://www.snapeda.com/parts/BSS123W/taiwan/view-part/?ref=snap
Q3A Q4A Q5A Q6A Q9A Q10A Q11A Q12A = balancer:SIR882DP-T1-GE3; COPYRIGHT: Copyright (C) 2026 Ultra Librarian. All rights reserved.; DATASHEET: https://www.vishay.com/doc?65932; DESCRIPTION: N-CHANNEL 100-V (D-S) MOSFET; MANUFACTURER_NAME: Vishay; MANUFACTURER_PART_NUMBER: SIR882DP-T1-GE3
Q3B Q4B Q5B Q6B Q9B Q10B Q11B Q12B = SIS892DN:SIS468DN-T1-GE3: Check availability <https://pricing.snapeda.com/parts/SIS468DN-T1-GE3/Vishay%20Siliconix/view-part?ref=eda>; AVAILABILITY: In Stock; CHECK_PRICES: https://www.snapeda.com/parts/SIS468DN-T1-GE3/Vishay/view-part/?ref=eda; DESCRIPTION: N-Channel 80 V 30A (Tc) 3.7W (Ta), 52W (Tc) Surface Mount PowerPAK® 1212-8; MF: Vishay Siliconix; MP: SIS468DN-T1-GE3; PACKAGE: PowerPAK®-1212 Vishay; PRICE: None; SNAPEDA_LINK: https://www.snapeda.com/parts/SIS468DN-T1-GE3/Vishay/view-part/?ref=snap
Q4 = MMBT3906LT1G:MMBT3906LT1G; CREATOR: ASHISH; MANUFACTURER: Onsemi; MAXIMUM_PACKAGE_HEIGHT: 1.11mm; PARTREV: 14; STANDARD: IPC-7351B
Q5 = FDN5618P:FDN5618P
Q6 = balancer:CMPT3904E_TR_PBFREE; COPYRIGHT: Copyright (C) 2026 Ultra Librarian. All rights reserved.; MANUFACTURER_NAME: Central Semiconductor; MANUFACTURER_PART_NUMBER: CMPT3904E TR PBFREE
R1 R3C R3F R3G R3H R4 R4C R4F R4G R4H R5C R5F R5G R5H R6 R6C R6F R6G R6H R7 R8 R9C R9F R9G R9H R10 R10C R10F R10G R10H R11C R11F R11G R11H R12C R12F R12G R12H R19-R22 R24 R53-R56 R58 = Ilya_Teach:RES
R3A R3B R3J R4A R4B R4J R5A R5B R5J R6A R6B R6J R9A R9B R9J R10A R10B R10J R11 R11A R11B R11J R12 R12A R12B R12J R15 R16 = rcl:R-US_: RESISTOR, American symbol; SPICEPREFIX: R
RS3A RS3B RS4A RS4B RS5A RS5B RS6A RS6B RS9A RS9B RS10A RS10B RS11A RS11B RS12A RS12B = PRL1632-R010-F-T1:PRL1632-R010-F-T1
T3-T6 T9-T12 = 750312504:750312504
U1 U2 = balancer:LTC3300ILXE-1PBF; COPYRIGHT: Copyright (C) 2026 Ultra Librarian. All rights reserved.; DATASHEET: https://www.analog.com/media/en/technical-documentation/data-sheets/LTC3300-1.pdf; DESCRIPTION: High Efficiency Bidirectional Multicell Battery Balancer; MANUFACTURER_NAME: Analog Devices Inc; MANUFACTURER_PART_NUMBER: LTC3300ILXE-1#PBF; TYPE: Power Management